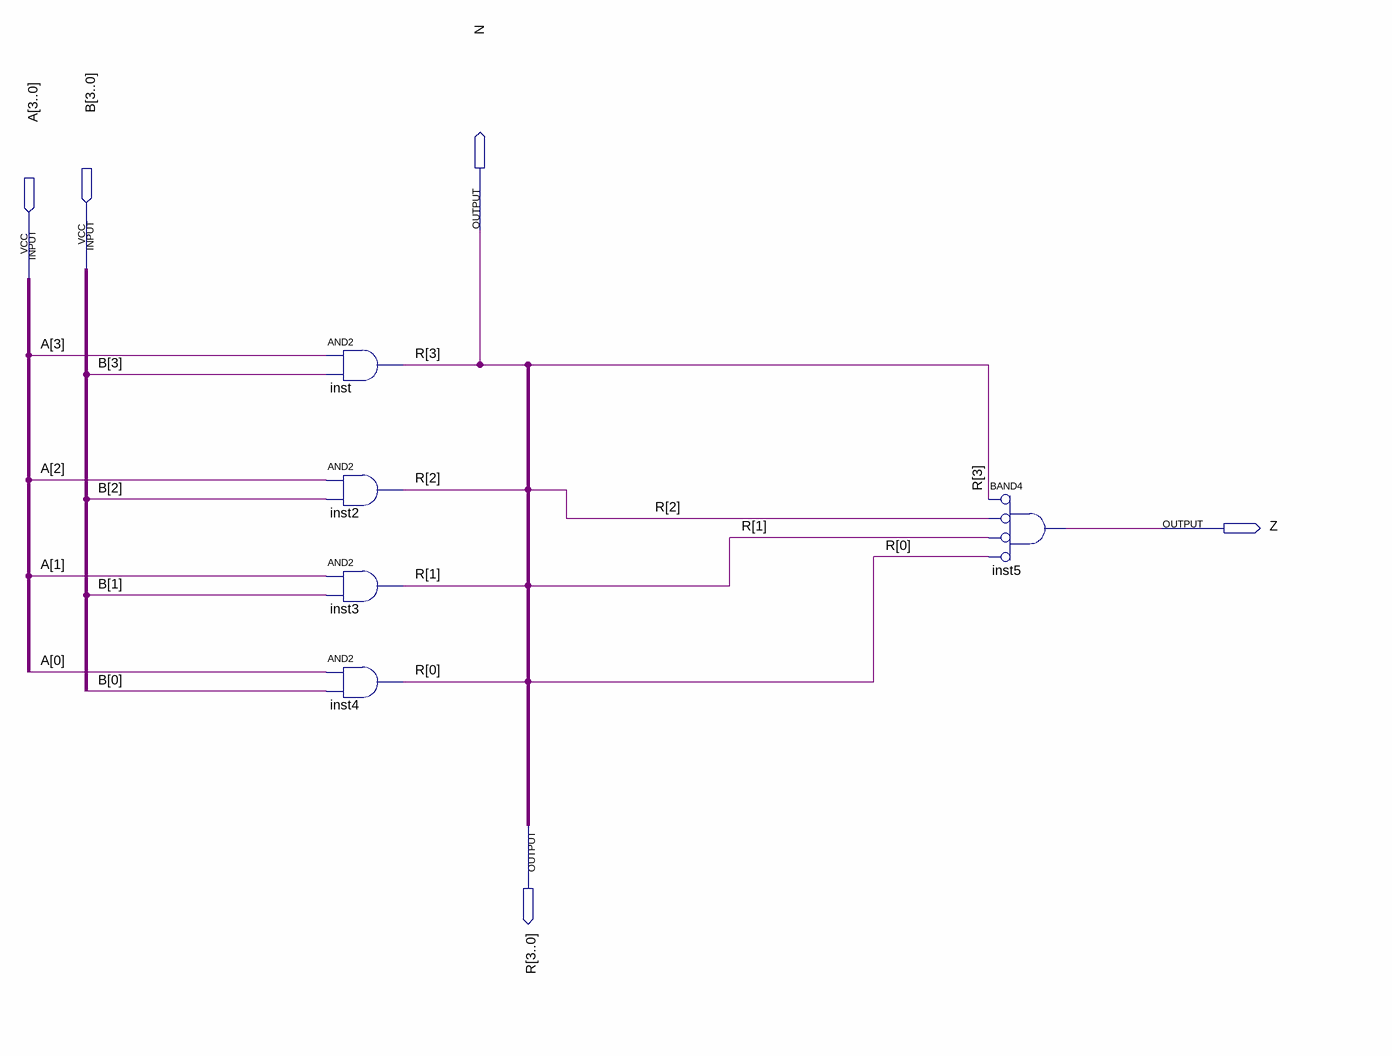
[diagram p0: schematic sheet]
// Quartus schematic BloqueAND.bdf as structural Verilog: 5 symbols, 5 pins
module BloqueAND (
  input  [3:0] B,
  input  [3:0] A,
  output N,
  output Z,
  output [3:0] R
);

  and inst (N, A[3], B[3]);
  and inst2 (R[2], A[2], B[2]);
  and inst3 (R[1], A[1], B[1]);
  and inst4 (R[0], A[0], B[0]);
  and inst5 (Z, ~N, ~R[2], ~R[1], ~R[0]);  // BAND4

  assign R[3] = N;
endmodule
